# Altium schematic sheet Buck-Boost converter (A).SchDoc
size A4; SheetNumber: 5; SheetTotal: 10
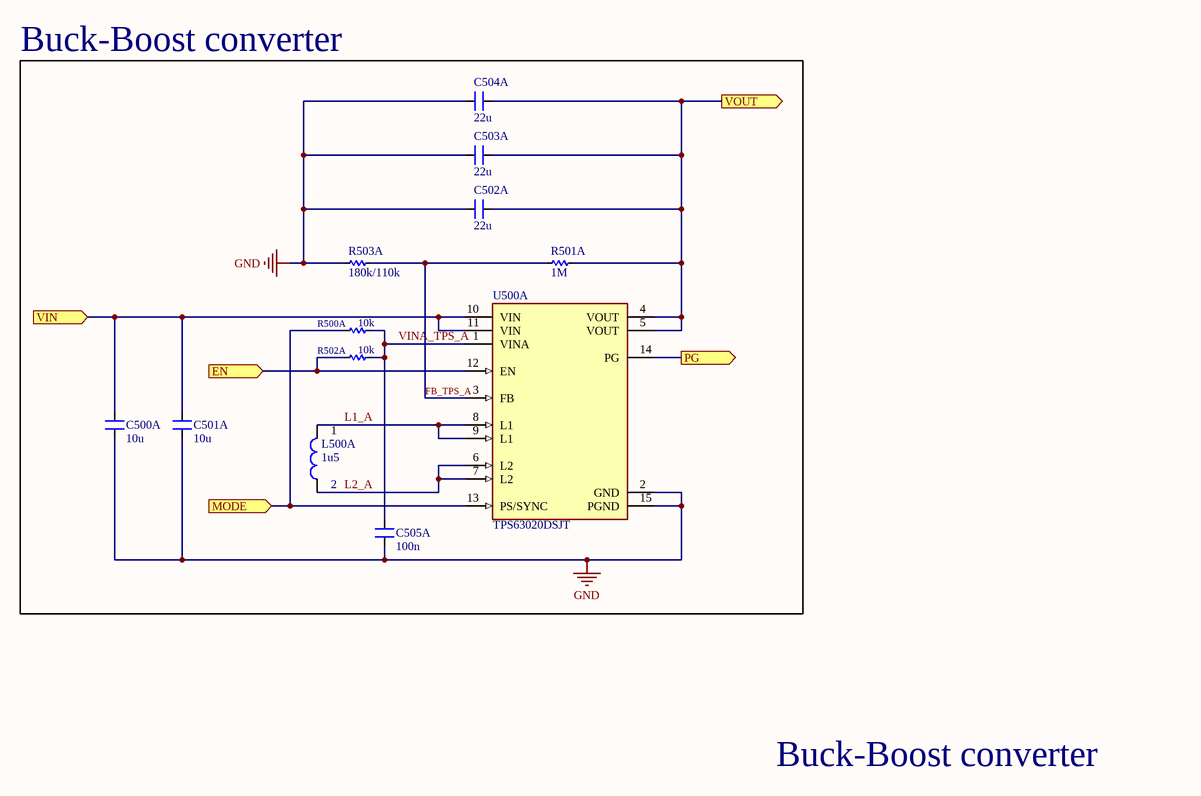
[diagram p0: Buck-Boost converter (A).SchDoc]

## Parts
C500A  10u  [CN-SMD-0603]
C501A  10u  [CN-SMD-0603]
C502A  22u  [CN-SMD-0603]
C503A  22u  [CN-SMD-0603]
C504A  22u  [CN-SMD-0603]
C505A  100n  [CN-SMD-0603]
L500A  1u5  [L-SMD-0630]
R500A  10k  [RES-SMD-0603]
R501A  1M  [RES-SMD-0603]
R502A  10k  [RES-SMD-0603]
R503A  180k/110k  [RES-SMD-0603]
U500A  TPS63020DSJT  [FP-DSJ0014A-MFG]

## Ports
EN (in, see BD[3A], Buck-Boost converter (B)[2C]), MODE (in, see BD[3A]), PG (out, see BD[3A]), VIN (in, see BD[3A], Buck-Boost converter (B)[1B]), VOUT (out, see BD[3A])

## Nets
GND: C500A.1 C501A.1 C502A.2 C503A.2 C504A.2 C505A.1 R503A.2 U500A.2(GND) U500A.15(PGND)
EN: R502A.2 U500A.12(EN) ; port EN
FB_TPS_A: R501A.2 R503A.1 U500A.3(FB)
L1_A: L500A.2 U500A.8(L1) U500A.9(L1)
L2_A: L500A.1 U500A.6(L2) U500A.7(L2)
MODE: R500A.2 U500A.13(PS/SYNC) ; port MODE
PG: U500A.14(PG) ; port PG
VIN: C500A.2 C501A.2 U500A.10(VIN) U500A.11(VIN) ; port VIN
VINA_TPS_A: C505A.2 R500A.1 R502A.1 U500A.1(VINA)
VOUT: C502A.1 C503A.1 C504A.1 R501A.1 U500A.4(VOUT) U500A.5(VOUT) ; port VOUT

## Notes on the sheet
- Buck-Boost converter
- (near L500A) 1
- (near L500A) 2

## Library data of the parts
C500A C501A C502A C503A C504A C505A = CN: Value: 33pF
L500A = L-SMD-1: partNo: 78477010; Manufacturer: Wurth Elektronik; Inductance: 1.0 μH; ComponentLink1Description: Manufacturer; ComponentLink1URL: http://www.we-online.de; Created by: Baojun Chen; Created Date: Nov.2015; ComponentLink2Description: Datasheet; ComponentLink2URL: http://katalog.we-online.de/pbs/datasheet/78477010.pdf
R500A R501A R502A R503A = Res-SMD: Resistor; Manufacturer: Generic Components; Class: Passive; Published: 08/06/2000; Publisher: Altium Hobart Technology Centre
U500A = CMP-2000-07282-2: IC REG BCK BST ADJ 3.5A 14VSON; Manufacturer: Texas Instruments; Switching Frequency: 2400kHz; Output Voltage: 1.2-5.5V; Nominal Supply Current: 25uA; Standoff Height: 0mm; Switching Topology: Buck-Boost; Min Supply Voltage: 1.8V; Output Type: AdjustableProgrammable; Max Junction Temp: +125°C; Number Of Outputs: 1; Output Current: 3A; Max Supply Voltage: 5.5V; ComponentLink2URL: https://www.ti.com/lit/ds/symlink/tps63020.pdf; Ambient Temperature Range High: +85°C; Digikey Description: IC REG BCK BST ADJ 3.5A 14VSON; Ambient Temperature Range Low: -40°C; Manufacturer Part Number: TPS63020DSJT; Automotive: No; Package: DSJ0014A; Category: IC; Temperature Range High: +85°C; Temperature: -40°C to +85°C; Octopart: https://octopart.com/tps63020dsjt-texas+instruments-12976119; Temperature Range Low: -40°C; Device Class L3: Voltage Regulators - Switching; Device Class L2: Power Management ICs; RoHS: TRUE; Lead Free: Yes; Height: 1mm; Device Class L1: Integrated Circuits (ICs); Mouser Description: Voltage Regulators - Switching Regulators 93% Eff Buck-Boost Converter; ComponentLink2Description: Datasheet